# EAGLE schematic dtmf_rx (EAGLE 7.3.0)
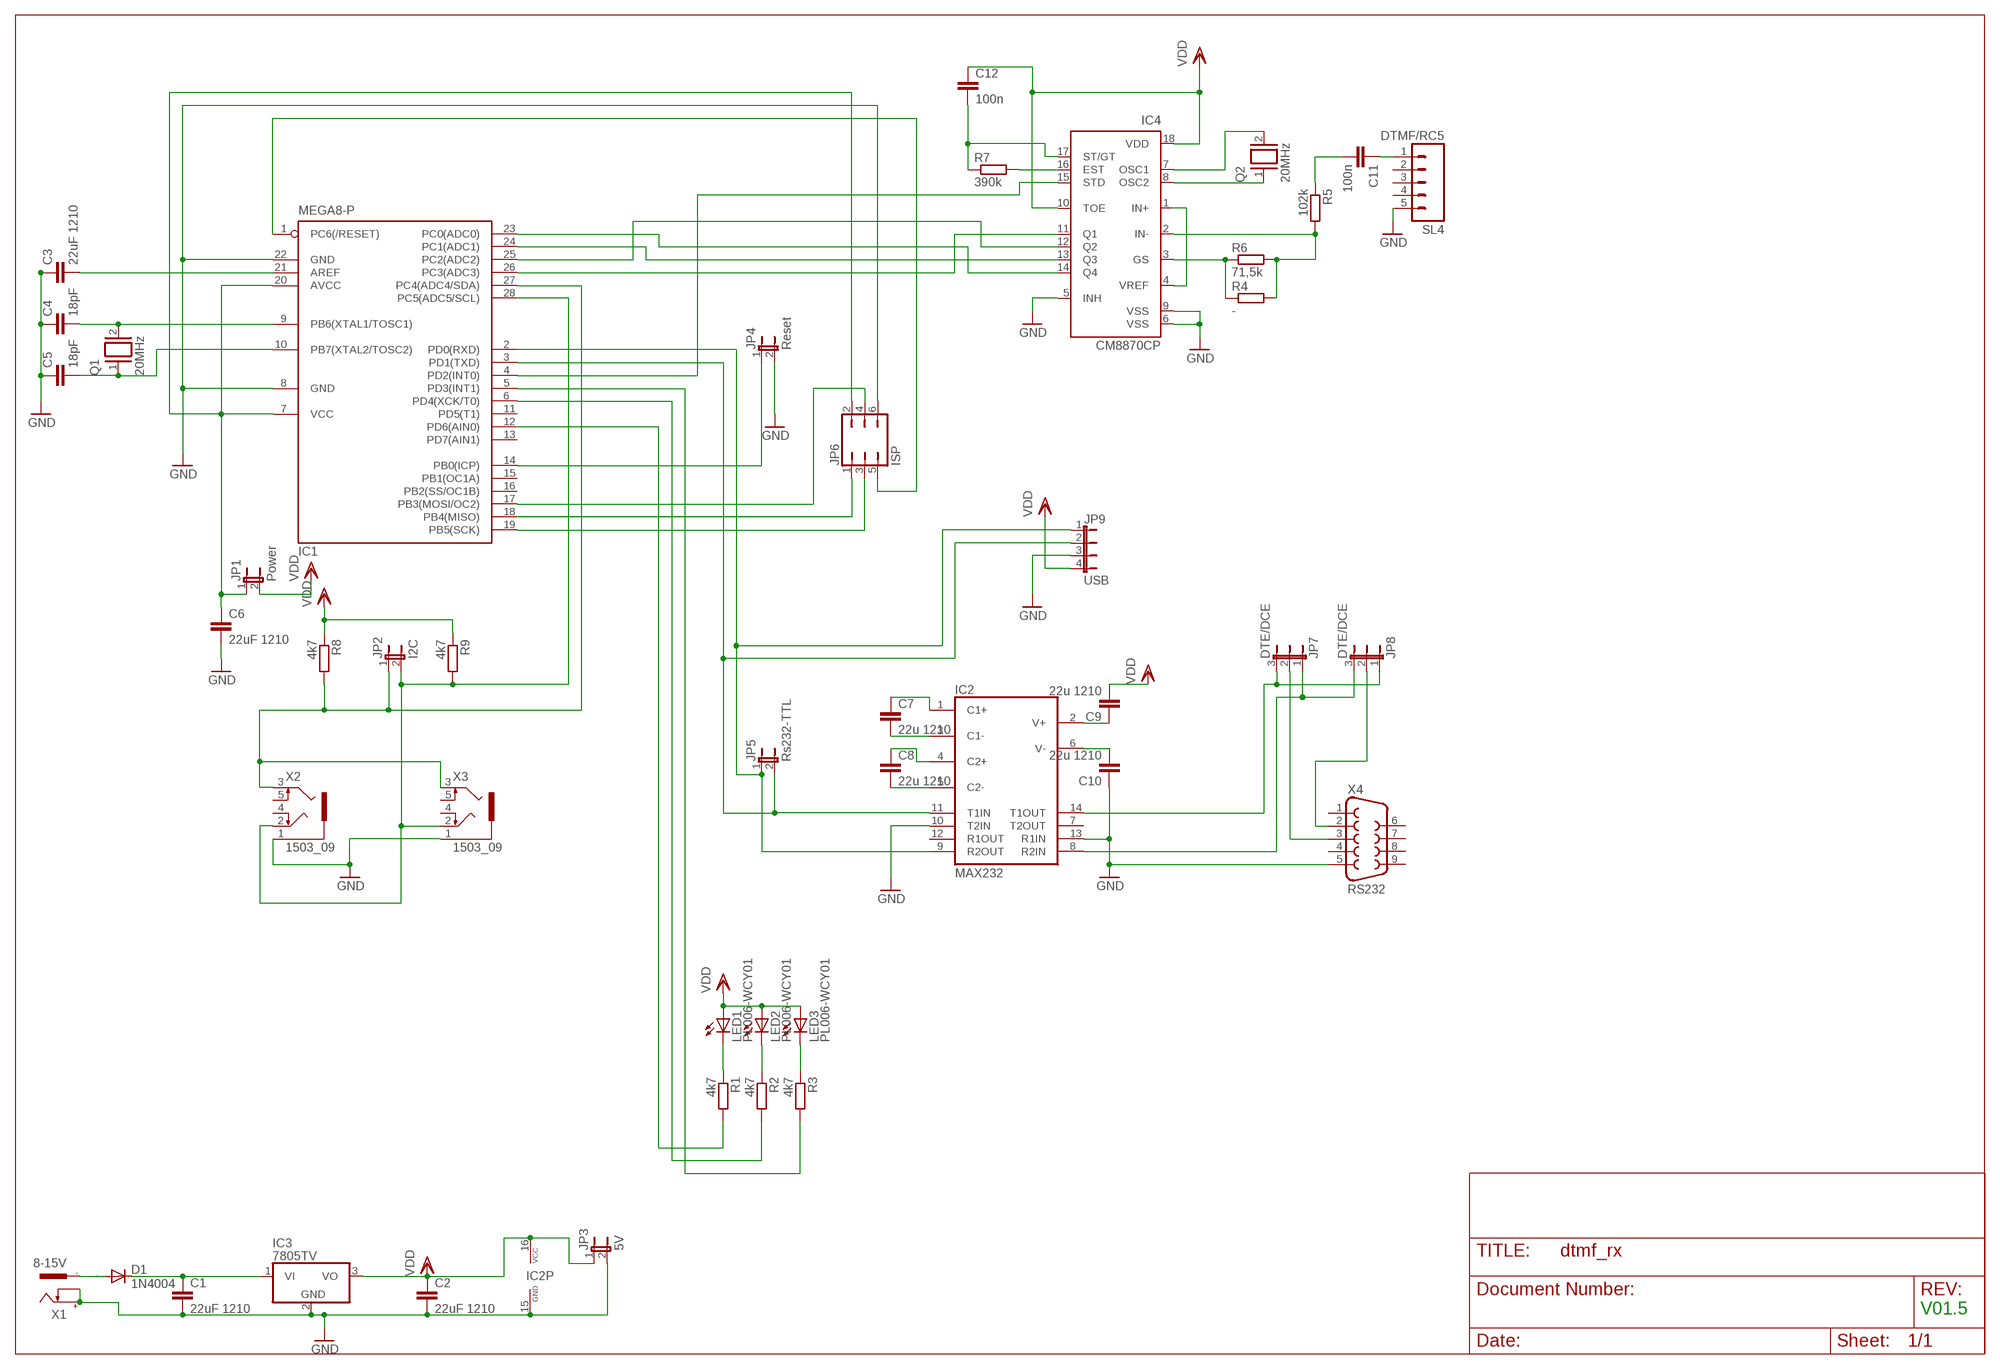
[diagram p0: schematic, sheet 1]

## Parts
C1  22uF 1210  C-EUC1206  [C1206]
C2  22uF 1210  C-EUC1206  [C1206]
C3  22uF 1210  C-EUC1206  [C1206]
C4  18pF  C-EU025-025X050  [C025-025X050]
C5  18pF  C-EU025-025X050  [C025-025X050]
C6  22uF 1210  C-EUC1206  [C1206]
C7  22u 1210  C-EUC1206  [C1206]
C8  22u 1210  C-EUC1206  [C1206]
C9  22u 1210  C-EUC1206  [C1206]
C10  22u 1210  C-EUC1206  [C1206]
C11  100n  C-EU050-025X075  [C050-025X075]
C12  100n  C-EU050-025X075  [C050-025X075]
D1  1N4004  [DO41-10]
IC1  MEGA8-P  [DIL28-3]
IC2  MAX232  [DIL16]
IC3  7805TV  [TO220V]
IC4  CM8870CP  [DIL18]
JP1  Power  JP1E  [JP1]
JP2  I2C  JP1E  [JP1]
JP3  5V  JP1E  [JP1]
JP4  Reset  JP1E  [JP1]
JP5  Rs232-TTL  JP1E  [JP1]
JP6  ISP  JP3Q  [JP3Q]
JP7  DTE/DCE  JP2E  [JP2]
JP8  DTE/DCE  JP2E  [JP2]
JP9  USB  JP4E  [JP4]
LED1  PL006-WCY01  [SOT23]
LED2  PL006-WCY01  [SOT23]
LED3  PL006-WCY01  [SOT23]
Q1  20MHz  XTAL/S  [QS]
Q2  20MHz  XTAL/S  [QS]
R1  4k7  R-EU_0207/5V  [0207/5V]
R2  4k7  R-EU_0207/5V  [0207/5V]
R3  4k7  R-EU_0207/5V  [0207/5V]
R4  -  R-EU_0207/5V  [0207/5V]
R5  102k  R-EU_0207/5V  [0207/5V]
R6  71,5k  R-EU_0207/5V  [0207/5V]
R7  390k  R-EU_0207/5V  [0207/5V]
R8  4k7  R-EU_0207/5V  [0207/5V]
R9  4k7  R-EU_0207/5V  [0207/5V]
SL4  DTMF/RC5  M05  [05P]
X1  8-15V  737992-55  [737992-5]
X2  1503_09  [1503_09]
X3  1503_09  [1503_09]
X4  RS232  F09H  [F09H]

## Nets
C13: C7.1 IC2.1(C1+)
GND: C1.2 C2.2 C3.1 C4.1 C5.1 C6.2 C10.1 IC1.8(GND) IC1.22(GND) IC2.10(T2IN) IC2.13(R1IN) IC2.15(GND) IC3.2(GND) IC4.5(INH) IC4.6(VSS) IC4.9(VSS) JP3.2 JP4.2 JP6.6 JP9.3 SL4.5 X1.+ X1.K X2.1 X3.1 X4.5
N$1: IC1.12(PD6(AIN0)) R1.2
N$2: IC1.2(PD0(RXD)) IC2.9(R2OUT) JP5.1 JP9.1
N$3: C8.2 IC2.5(C2-)
N$4: JP8.2 X4.2
N$5: IC1.27(PC4(ADC4/SDA)) JP2.1 R8.2 X2.3 X3.3
N$6: IC1.14(PB0(ICP)) JP4.1
N$7: IC4.1(IN+) IC4.4(VREF)
N$8: IC1.23(PC0(ADC0)) IC4.14(Q4)
N$9: JP7.2 X4.3
N$10: IC2.14(T1OUT) JP7.3 JP8.1
N$11: IC2.8(R2IN) JP7.1 JP8.3
N$12: IC1.3(PD1(TXD)) IC2.11(T1IN) JP5.2 JP9.2
N$13: C8.1 IC2.4(C2+)
N$14: C7.2 IC2.3(C1-)
N$15: IC1.18(PB4(MISO)) JP6.1
N$16: C9.1 IC2.2(V+)
N$17: C10.2 IC2.6(V-)
N$18: IC1.1(PC6(/RESET)) JP6.5
N$19: C4.2 IC1.9(PB6(XTAL1/TOSC1)) Q1.2
N$20: IC1.19(PB5(SCK)) JP6.3
N$21: C11.1 SL4.1
N$22: IC1.28(PC5(ADC5/SCL)) JP2.2 R9.2 X2.2 X3.2
N$23: IC1.6(PD4(XCK/T0)) R2.2
N$24: C11.2 R5.1
N$25: IC4.2(IN-) R4.2 R5.2 R6.2
N$26: IC4.3(GS) R4.1 R6.1
N$27: D1.A X1.-1
N$28: IC1.17(PB3(MOSI/OC2)) JP6.4
N$29: IC4.8(OSC2) Q2.1
N$30: IC1.24(PC1(ADC1)) IC4.13(Q3)
N$31: IC4.7(OSC1) Q2.2
N$32: IC4.16(EST) R7.2
N$33: C1.1 D1.C IC3.1(VI)
N$34: IC1.26(PC3(ADC3)) IC4.11(Q1)
N$35: C3.2 IC1.21(AREF)
N$37: C5.2 IC1.10(PB7(XTAL2/TOSC2)) Q1.1
N$38: IC1.25(PC2(ADC2)) IC4.12(Q2)
N$40: C12.2 IC4.17(ST/GT) R7.1
N$42: IC1.4(PD2(INT0)) IC4.15(STD)
N$44: C6.1 IC1.7(VCC) IC1.20(AVCC) JP1.1 JP6.2
N$48: LED3.3(C) R3.1
N$49: LED2.3(C) R2.1
N$50: LED1.3(C) R1.1
N$51: IC1.5(PD3(INT1)) R3.2
VDD: C2.1 C9.2 C12.1 IC2.16(VCC) IC3.3(VO) IC4.10(TOE) IC4.18(VDD) JP1.2 JP3.1 JP9.4 LED1.1(A) LED2.1(A) LED3.1(A) R8.1 R9.1
Unconnected: IC1.11(PD5(T1)) IC1.13(PD7(AIN1)) IC1.15(PB1(OC1A)) IC1.16(PB2(SS/OC1B)) IC2.7(T2OUT) IC2.12(R1OUT) SL4.2 SL4.3 SL4.4 X1.-2 X2.4 X2.5 X3.4 X3.5 X4.1 X4.4 X4.6 X4.7 X4.8 X4.9

## Notes on the sheet
- V01.5

## Library data of the parts
C1-C3 C6-C12 = rcl:C-EU: CAPACITOR, European symbol
C4 C5 = resistor:C-EU: CAPACITOR, European symbol
D1 = diode:1N4004: DIODE general purpose rectifier, 1 A
IC1 = atmel:MEGA8-P: MICROCONTROLLER 8 Kbytes FLASH, 1 kbytes SRAM, 512 bytes EEPROM, USART, 4-channel 10 bit ADC, 2-channel 8 bit ADC Pin compatible with Atmega48, ATMega88, ATMega168 Source: avr.lbr; OC_FARNELL: unknown; OC_NEWARK: unknown
IC2 = maxim:MAX232: RS232 TRANSCEIVER; MF: MAXIM; MPN: MAX232ACPE+; OC_FARNELL: 9723773; OC_NEWARK: 68K4544
IC3 = linear:78*: Positive VOLTAGE REGULATOR Source: http://cache.national.com/ds/LM/LM78L05.pdf http://www.fairchildsemi.com/ds/LM/LM7805.pdf
IC4 = california-micro-devices:CM8870C: CMOS Integrated DTMF Receiver cm8870.pdf; OC_FARNELL: unknown; OC_NEWARK: unknown
JP1-JP5 = jumper:JP1E: JUMPER
JP6 = jumper:JP3Q: JUMPER
JP7 JP8 = jumper:JP2E: JUMPER
JP9 = jumper:JP4E: JUMPER
LED1-LED3 = led:PL006*: PLH006 Series SMD LED SOT23 PLH006-WCR21 Super Red PLH006-WCR12 High Eff Red PLH006-WCG13 Green PLH006-WCY01 Yellow www.p-tec.net Source: http://www.wittig-electronic.de/PTEC/PL006Series.pdf
Q1 Q2 = special:XTAL/S: CRYSTAL
R1-R9 = resistor:R-EU_: RESISTOR, European symbol
SL4 = con-amp-quick:M05: AMP QUICK CONNECTOR; OC_FARNELL: unknown; OC_NEWARK: unknown
X1 = con-conrad:737992-55: FEMALE PRINT CONNECTOR DIN 45323 (34V/3A), ROKA, distributor Conrad
X2 X3 = con-lumberg:1503_09: Jack connectors according to JISC 6560, 3.5 mm Klinkeneinbaukupplung nach JISC 6560, 3,5 mm, 3-polig/ stereo, abgewinkelte Ausführung, mit 2 Öffnern und Lötaugen, für Leiterplatten Rückseitenmontage Source: http://www.lumberg.com/Produkte/PDFs/1503_09.pdf; OC_FARNELL: 1243244; OC_NEWARK: unknown
X4 = con-subd:F09: SUB-D; OC_FARNELL: unknown; OC_NEWARK: unknown